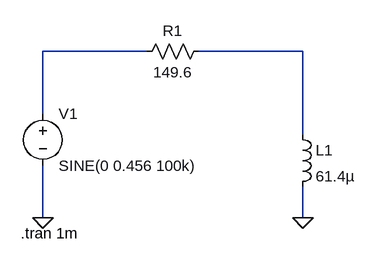
[diagram p0: schematic Draft1.asc]
Draft1.asc, the LTspice schematic file:
Version 4
SHEET 1 880 680
WIRE 160 64 0 64
WIRE 400 64 240 64
WIRE 0 160 0 64
WIRE 400 192 400 64
WIRE 0 320 0 240
WIRE 400 320 400 272
FLAG 0 320 0
FLAG 400 320 0
SYMBOL voltage 0 144 R0
WINDOW 123 0 0 Left 0
WINDOW 39 0 0 Left 0
SYMATTR InstName V1
SYMATTR Value SINE(0 0.456 100k)
SYMBOL res 256 48 R90
WINDOW 0 0 56 VBottom 2
WINDOW 3 32 56 VTop 2
SYMATTR InstName R1
SYMATTR Value 149.6
SYMBOL ind 384 176 R0
SYMATTR InstName L1
SYMATTR Value 61.4µ
TEXT -34 344 Left 2 !.tran 1m

The netlist it stands for:
* Draft1.asc
V1 N001 0 SINE(0 0.456 100k)
R1 N002 N001 149.6
L1 N002 0 61.4µ
.tran 1m
.backanno
.end